# Altium project smart_charger.PrjPcb
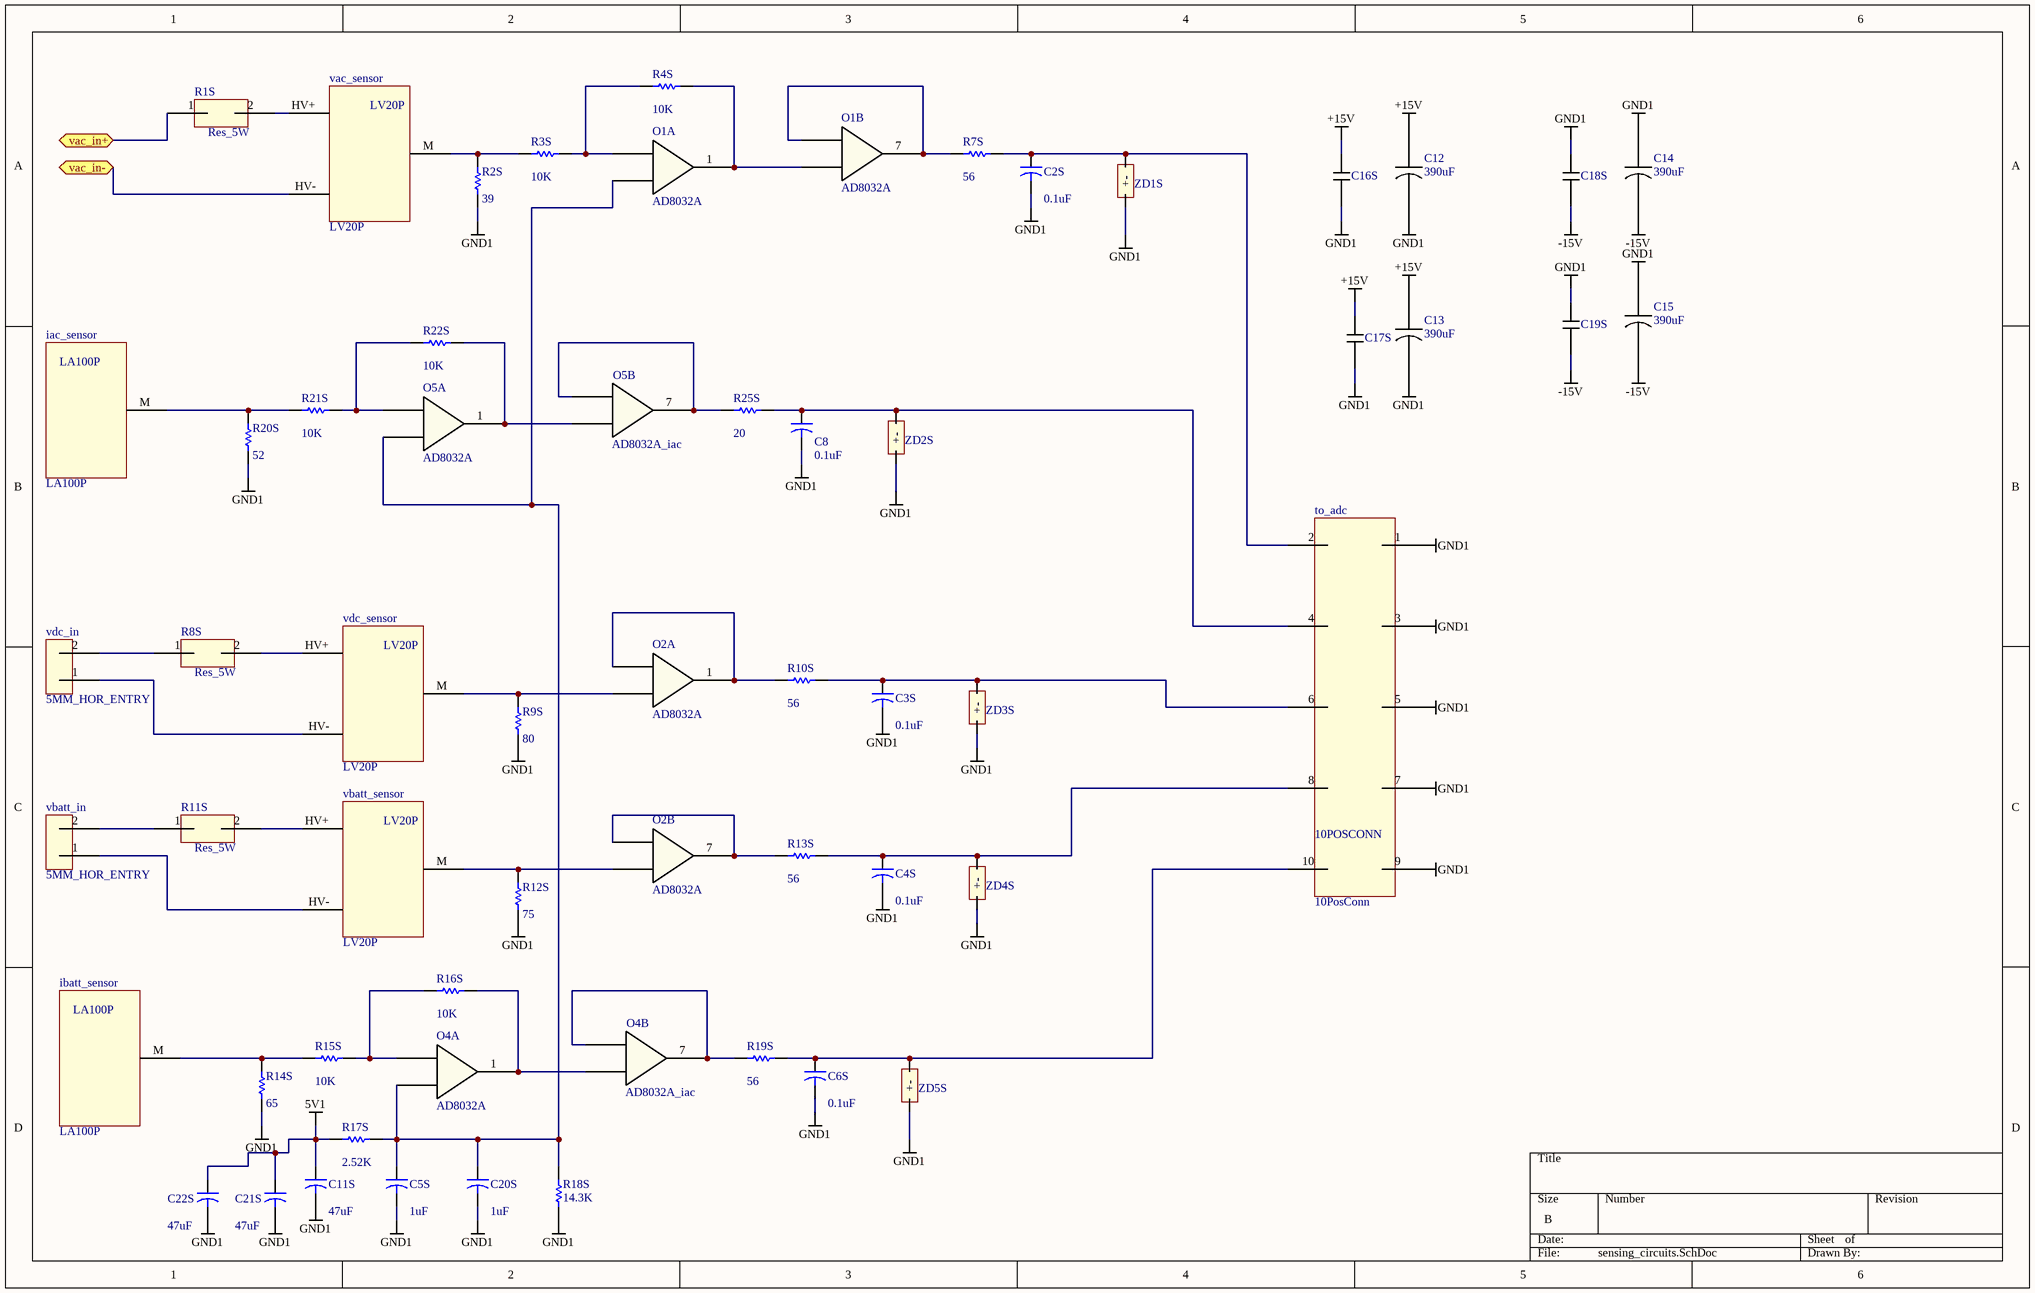
[diagram p0: sensing_circuits.SchDoc]
4 sheets, 179 parts. Net scope: flat (ports and power ports of the same name join across sheets).
Board file: smart_charger_pcb.PcbDoc
Sheets:
  sensing_circuits.SchDoc
  fo_tx_array.SchDoc
  gate_driver_array.SchDoc
  power_supplies.SchDoc

## Sheet sensing_circuits.SchDoc
size B

### Parts
C2S  value 0.1uF  [CAPR5-4X5]  (hidden comment: C2)
C3S  value 0.1uF  [CAPR5-4X5]  (hidden comment: C3)
C4S  value 0.1uF  [CAPR5-4X5]  (hidden comment: C4)
C5S  value 1uF  [CAPR5-4X5]  (hidden comment: C5)
C6S  value 0.1uF  [CAPR5-4X5]  (hidden comment: C6)
C8S  C8  value 0.1uF  [CAPR5-4X5]
C11S  value 47uF  [CAPR5-4X5]  (hidden comment: C11)
C12  Capacitance: 390uF  [Cap_Pol_5mm]  (hidden comment: C12)
C13  Capacitance: 390uF  [Cap_Pol_5mm]  (hidden comment: C12)
C14  Capacitance: 390uF  [Cap_Pol_5mm]  (hidden comment: C12)
C15  Capacitance: 390uF  [Cap_Pol_5mm]  (hidden comment: C12)
C16S  CAP_CERAM_5MM  [CAP_CERAM_5MM]  (value not drawn)
C17S  CAP_CERAM_5MM  [CAP_CERAM_5MM]  (value not drawn)
C18S  CAP_CERAM_5MM  [CAP_CERAM_5MM]  (value not drawn)
C19S  CAP_CERAM_5MM  [CAP_CERAM_5MM]  (value not drawn)
C20S  value 1uF  [CAPR5-4X5]  (hidden comment: C20)
C21S  value 47uF  [CAPR5-4X5]  (hidden comment: C21)
C22S  value 47uF  [CAPR5-4X5]  (hidden comment: C22)
iac_sensor  LA100P  [LA100P]
ibatt_sensor  LA100P  [LA100P]
O1  AD8032A  [AD8032A]  (parts A,B of 2)
O2  AD8032A  [AD8032A]  (parts A,B of 2)
O4  AD8032A  [AD8032A]  (parts A,B of 2)
O5  AD8032A  [AD8032A]  (parts A,B of 2)
R1S  R1  [Res_Vishay_5W]  (value not drawn)
R2S  value 39  [AXIAL-0.3]  (hidden comment: R2)
R3S  value 10K  [AXIAL-0.3]  (hidden comment: R3)
R4S  value 10K  [AXIAL-0.3]  (hidden comment: R4)
R7S  value 56  [AXIAL-0.3]  (hidden comment: R7)
R8S  R8  [Res_Vishay_5W]  (value not drawn)
R9S  value 80  [AXIAL-0.3]  (hidden comment: R9)
R10S  value 56  [AXIAL-0.3]  (hidden comment: R10)
R11S  R11  [Res_Vishay_5W]  (value not drawn)
R12S  value 75  [AXIAL-0.3]  (hidden comment: R12)
R13S  value 56  [AXIAL-0.3]  (hidden comment: R13)
R14S  value 65  [AXIAL-0.3]  (hidden comment: R14)
R15S  value 10K  [AXIAL-0.3]  (hidden comment: R15)
R16S  value 10K  [AXIAL-0.3]  (hidden comment: R16)
R17S  value 2.52K  [AXIAL-0.3]  (hidden comment: R17)
R18S  value 14.3K  [AXIAL-0.3]  (hidden comment: R18)
R19S  value 56  [AXIAL-0.3]  (hidden comment: R19)
R20S  value 52  [AXIAL-0.3]  (hidden comment: R20)
R21S  value 10K  [AXIAL-0.3]  (hidden comment: R21)
R22S  value 10K  [AXIAL-0.3]  (hidden comment: R22)
R25S  value 20  [AXIAL-0.3]  (hidden comment: R25)
to_adc  10PosConn  [Conn_10Pos]
vac_sensor  LV20P  [LV20P]
vbatt_in  5MM_HOR_ENTRY  [5MM_HOR_ENTRY]
vbatt_sensor  LV20P  [LV20P]
vdc_in  5MM_HOR_ENTRY  [5MM_HOR_ENTRY]
vdc_sensor  LV20P  [LV20P]
ZD1S  ZENER_0.4W  [ZENER400mW]  (value not drawn)
ZD2S  ZENER_0.4W  [ZENER400mW]  (value not drawn)
ZD3S  ZENER_0.4W  [ZENER400mW]  (value not drawn)
ZD4S  ZENER_0.4W  [ZENER400mW]  (value not drawn)
ZD5S  ZENER_0.4W  [ZENER400mW]  (value not drawn)

### Ports
vac_in+ (bidir), vac_in- (bidir)

### Nets
5V1: C11S.1 C21S.1 C22S.1 O1.8 O2.8 O4.8 O5.8 R17S.2
+15V: C12.1 C13.1 C16S.2 C17S.2 iac_sensor.+ ibatt_sensor.+ vac_sensor.+15V vbatt_sensor.+15V vdc_sensor.+15V
-15V: C14.2 C15.2 C18S.1 C19S.1 iac_sensor.- ibatt_sensor.- vac_sensor.-15V vbatt_sensor.-15V vdc_sensor.-15V
GND1: C2S.2 C3S.2 C4S.2 C5S.2 C6S.2 C8S.2 C11S.2 C12.2 C13.2 C14.1 C15.1 C16S.1 C17S.1 C18S.2 C19S.2 C20S.2 C21S.2 C22S.2 O1.4 O2.4 O4.4 O5.4 R2S.1 R9S.1 R12S.1 R14S.1 R18S.2 R20S.1 to_adc.1 to_adc.3 to_adc.5 to_adc.7 to_adc.9 ZD1S.1(+) ZD2S.1(+) ZD3S.1(+) ZD4S.1(+) ZD5S.1(+)
NetC2S_1: C2S.1 R7S.1 to_adc.2 ZD1S.2(-)
NetC3S_1: C3S.1 R10S.2 to_adc.6 ZD3S.2(-)
NetC4S_1: C4S.1 R13S.2 to_adc.8 ZD4S.2(-)
NetC5S_1: C5S.1 C20S.1 O1.3 O4.3 O5.3 R17S.1 R18S.1
NetC6S_1: C6S.1 R19S.1 to_adc.10 ZD5S.2(-)
NetC8S_1: C8S.1 R25S.1 to_adc.4 ZD2S.2(-)
NetFUSE1_1: R1S.1 ; port vac_in+
Netiac_sensor_M: iac_sensor.M R20S.2 R21S.2
Netibatt_sensor_M: ibatt_sensor.M R14S.2 R15S.2
NetO1_1: O1.1 O1.5 R4S.1
NetO1_2: O1.2 R3S.1 R4S.2
NetO1_6: O1.6 O1.7 R7S.2
NetO2_1: O2.1 O2.2 R10S.1
NetO2_3: O2.3 R9S.2 vdc_sensor.M
NetO2_5: O2.5 R12S.2 vbatt_sensor.M
NetO2_6: O2.6 O2.7 R13S.1
NetO4_1: O4.1 O4.5 R16S.1
NetO4_2: O4.2 R15S.1 R16S.2
NetO4_6: O4.6 O4.7 R19S.2
NetO5_1: O5.1 O5.5 R22S.1
NetO5_2: O5.2 R21S.1 R22S.2
NetO5_6: O5.6 O5.7 R25S.2
NetPS1_ACN: vac_sensor.HV- ; port vac_in-
NetR1S_2: R1S.2 vac_sensor.HV+
NetR2S_2: R2S.2 R3S.2 vac_sensor.M
NetR8S_1: R8S.1 vdc_in.2
NetR8S_2: R8S.2 vdc_sensor.HV+
NetR11S_1: R11S.1 vbatt_in.2
NetR11S_2: R11S.2 vbatt_sensor.HV+
Netvbatt_in_1: vbatt_in.1 vbatt_sensor.HV-
Netvdc_in_1: vdc_in.1 vdc_sensor.HV-

### Notes on the sheet
- (in symbol 10PosConn) 10POSCONN
- (in symbol Res_Vishay_5W) Res_5W

### Library data of the parts
C2S C3S C4S C5S C6S C8S C11S C20S C21S C22S = Cap2: Capacitor; Published: 23-Sep-2002; PackageReference: CAPR5-4X5; Publisher: Altium Limited; PackageDescription: Capacitor; 2 Leads
C12-C15 = Cap_Pol_5
R1S = Res_Vishay_5W: Resistance: 15k
R2S R3S R4S R7S R9S R10S R12S R13S R14S R15S R16S R17S R18S R19S R20S R21S R22S R25S = Res1: Resistor; Published: 8-Jun-2000; LatestRevisionDate: 17-Jul-2002; LatestRevisionNote: Re-released for DXP Platform.; PackageReference: AXIAL-0.3; Publisher: Altium Limited; PackageDescription: Axial Device, Thru-Hole; 2 Leads; 0.3 in Pin Spacing
R8S = Res_Vishay_5W: Resistance: 25k
R11S = Res_Vishay_5W: Resistance: 10k

## Sheet fo_tx_array.SchDoc
size A3
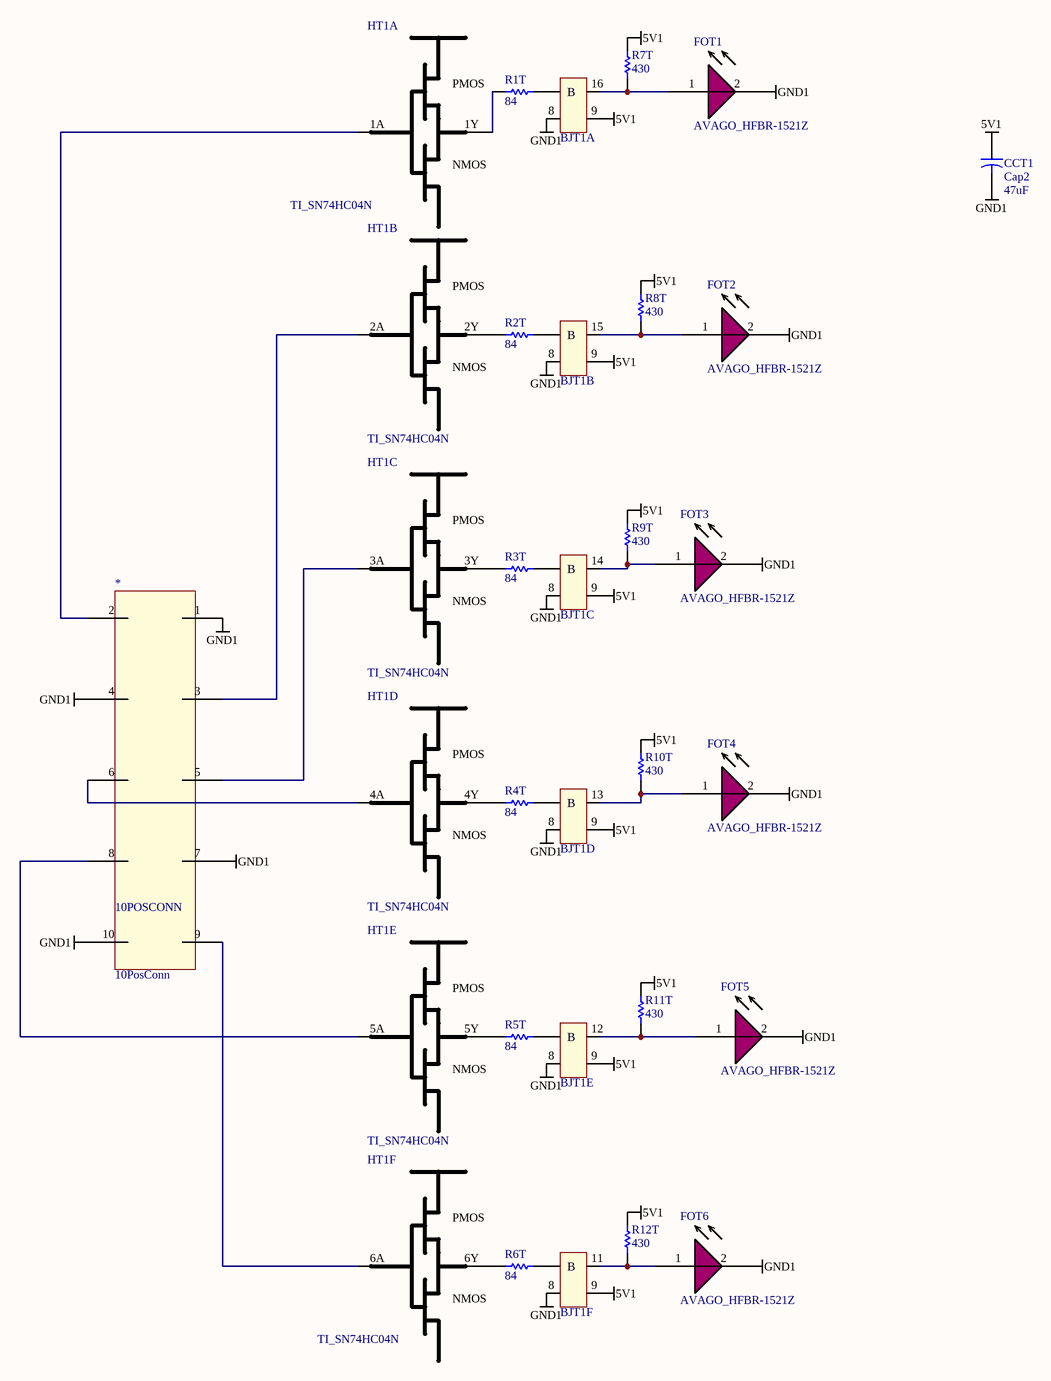
[diagram p1: fo_tx_array.SchDoc]

### Parts
*  10PosConn  [Conn_10Pos]
BJT1  ULN2003AN  [ULN2003AN]  (value not drawn)  (parts A,B,C,D,E,F of 7)
CCT1  Cap2  value 47uF  [CAPR5-4X5]
FOT1  AVAGO_HFBR-1521Z  [AVAGO_HFBR-1521Z]
FOT2  AVAGO_HFBR-1521Z  [AVAGO_HFBR-1521Z]
FOT3  AVAGO_HFBR-1521Z  [AVAGO_HFBR-1521Z]
FOT4  AVAGO_HFBR-1521Z  [AVAGO_HFBR-1521Z]
FOT5  AVAGO_HFBR-1521Z  [AVAGO_HFBR-1521Z]
FOT6  AVAGO_HFBR-1521Z  [AVAGO_HFBR-1521Z]
HT1  TI_SN74HC04N  [SN74HC04N]  (parts A,B,C,D,E,F of 7)
R1T  value 84  [AXIAL-0.3]
R2T  value 84  [AXIAL-0.3]
R3T  value 84  [AXIAL-0.3]
R4T  value 84  [AXIAL-0.3]
R5T  value 84  [AXIAL-0.3]
R6T  value 84  [AXIAL-0.3]
R7T  value 430  [AXIAL-0.3]  (hidden comment: Res1)
R8T  value 430  [AXIAL-0.3]  (hidden comment: Res1)
R9T  value 430  [AXIAL-0.3]  (hidden comment: Res1)
R10T  value 430  [AXIAL-0.3]  (hidden comment: Res1)
R11T  value 430  [AXIAL-0.3]  (hidden comment: Res1)
R12T  value 430  [AXIAL-0.3]  (hidden comment: Res1)

### Nets
5V1: BJT1.9(COM) CCT1.1 HT1.5V R7T.1 R8T.1 R9T.1 R10T.1 R11T.1 R12T.1
GND1: *.1 *.4 *.7 *.10 BJT1.8(E) CCT1.2 FOT1.2 FOT2.2 FOT3.2 FOT4.2 FOT5.2 FOT6.2 HT1.GND
Net*_2: *.2 HT1.1A
Net*_3: *.3 HT1.2A
Net*_5: *.5 HT1.3A
Net*_6: *.6 HT1.4A
Net*_8: *.8 HT1.5A
Net*_9: *.9 HT1.6A
NetBJT1_1: BJT1.1(B) R1T.2
NetBJT1_2: BJT1.2(B) R2T.2
NetBJT1_3: BJT1.3(B) R3T.2
NetBJT1_4: BJT1.4(B) R4T.2
NetBJT1_5: BJT1.5(B) R5T.2
NetBJT1_6: BJT1.6(B) R6T.2
NetBJT1_11: BJT1.11(C) FOT6.1 R12T.2
NetBJT1_12: BJT1.12(C) FOT5.1 R11T.2
NetBJT1_13: BJT1.13(C) FOT4.1 R10T.2
NetBJT1_14: BJT1.14(C) FOT3.1 R9T.2
NetBJT1_15: BJT1.15(C) FOT2.1 R8T.2
NetBJT1_16: BJT1.16(C) FOT1.1 R7T.2
NetHT1_1Y: HT1.1Y R1T.1
NetHT1_2Y: HT1.2Y R2T.1
NetHT1_3Y: HT1.3Y R3T.1
NetHT1_4Y: HT1.4Y R4T.1
NetHT1_5Y: HT1.5Y R5T.1
NetHT1_6Y: HT1.6Y R6T.1

### Notes on the sheet
- (in symbol 10PosConn) 10POSCONN
- (in symbol TI_SN74HC04N, part A) PMOS; NMOS
- (in symbol TI_SN74HC04N, part B) PMOS; NMOS
- (in symbol TI_SN74HC04N, part C) PMOS; NMOS
- (in symbol TI_SN74HC04N, part D) PMOS; NMOS
- (in symbol TI_SN74HC04N, part E) PMOS; NMOS
- (in symbol TI_SN74HC04N, part F) PMOS; NMOS

### Library data of the parts
CCT1 = Cap2: Capacitor; Published: 23-Sep-2002; PackageReference: CAPR5-4X5; Publisher: Altium Limited; PackageDescription: Capacitor; 2 Leads
FOT1-FOT6 = AVAGO_HFBR-1521Z: Optical Fiber Transmitter
HT1 = TI_SN74HC04N: Hex Inverter 5V
R1T R2T R3T R4T R5T R6T R7T R8T R9T R10T R11T R12T = Res1: Resistor; Published: 8-Jun-2000; LatestRevisionDate: 17-Jul-2002; LatestRevisionNote: Re-released for DXP Platform.; PackageReference: AXIAL-0.3; Publisher: Altium Limited; PackageDescription: Axial Device, Thru-Hole; 2 Leads; 0.3 in Pin Spacing

## Sheet gate_driver_array.SchDoc
size A3
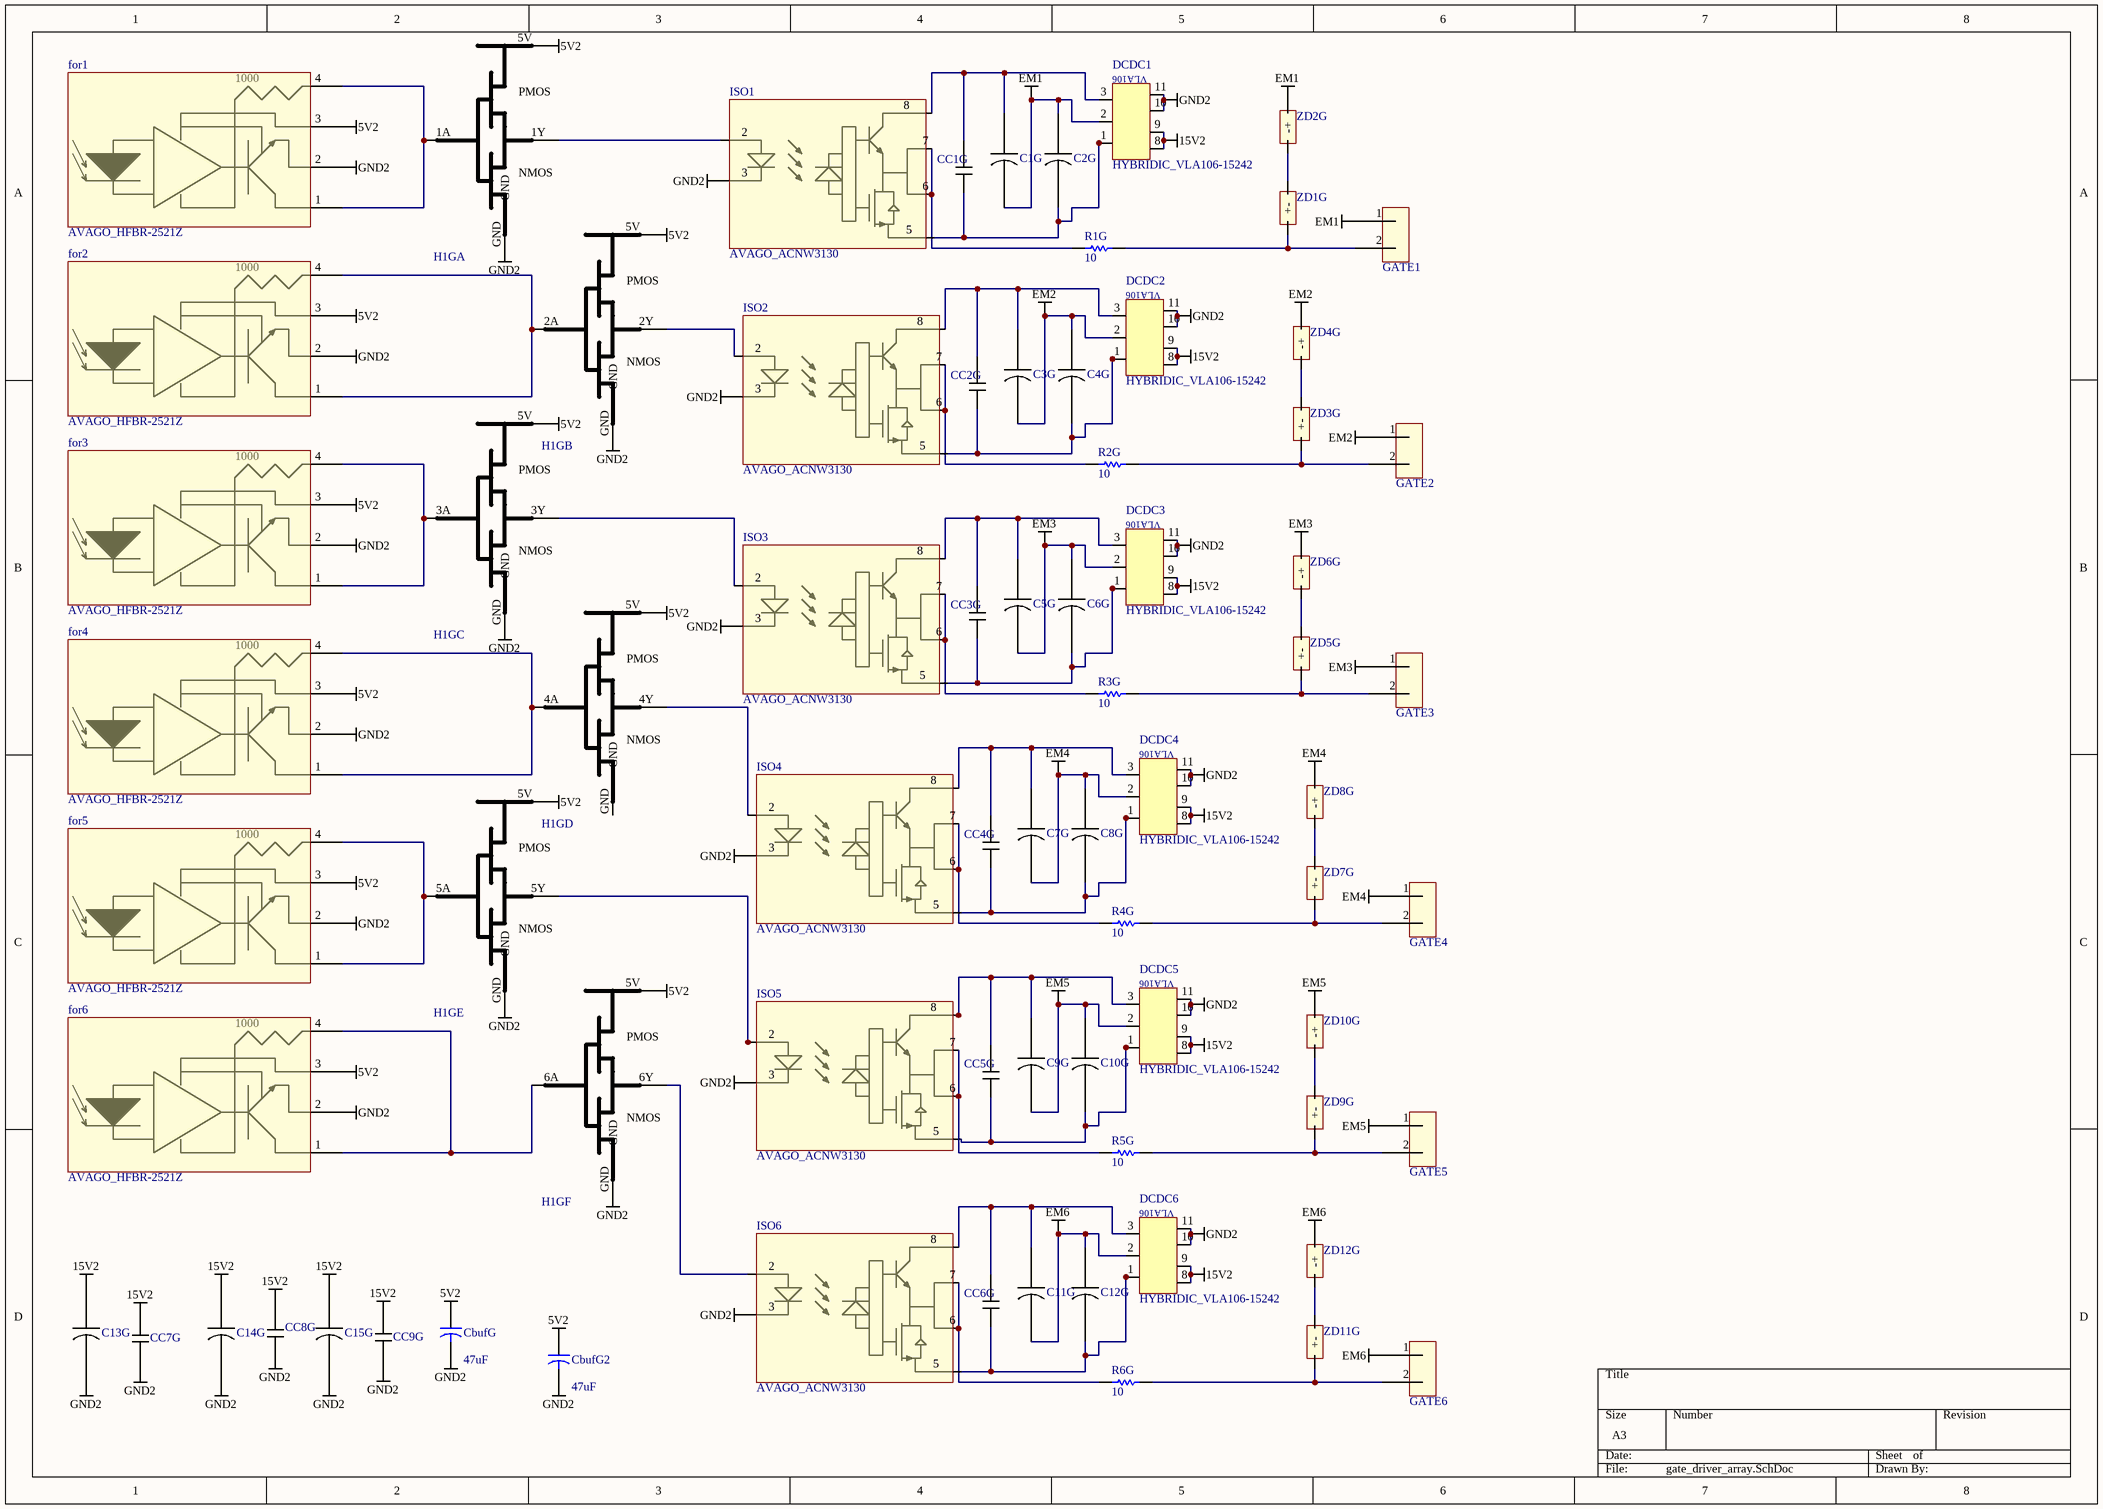
[diagram p2: gate_driver_array.SchDoc]

### Parts
C1G  Cap_Pol_5  [Cap_Pol_5mm]  (value not drawn)
C2G  Cap_Pol_5  [Cap_Pol_5mm]  (value not drawn)
C3G  Cap_Pol_5  [Cap_Pol_5mm]  (value not drawn)
C4G  Cap_Pol_5  [Cap_Pol_5mm]  (value not drawn)
C5G  Cap_Pol_5  [Cap_Pol_5mm]  (value not drawn)
C6G  Cap_Pol_5  [Cap_Pol_5mm]  (value not drawn)
C7G  Cap_Pol_5  [Cap_Pol_5mm]  (value not drawn)
C8G  Cap_Pol_5  [Cap_Pol_5mm]  (value not drawn)
C9G  Cap_Pol_5  [Cap_Pol_5mm]  (value not drawn)
C10G  Cap_Pol_5  [Cap_Pol_5mm]  (value not drawn)
C11G  Cap_Pol_5  [Cap_Pol_5mm]  (value not drawn)
C12G  Cap_Pol_5  [Cap_Pol_5mm]  (value not drawn)
C13G  Cap_Pol_5  [Cap_Pol_5mm]  (value not drawn)
C14G  Cap_Pol_5  [Cap_Pol_5mm]  (value not drawn)
C15G  Cap_Pol_5  [Cap_Pol_5mm]  (value not drawn)
CbufG  value 47uF  [CAPR5-4X5]  (hidden comment: Cap2)
CbufG2  value 47uF  [CAPR5-4X5]  (hidden comment: Cap2)
CC1G  CAP_CERAM_5MM  [CAP_CERAM_5MM]  (value not drawn)
CC2G  CAP_CERAM_5MM  [CAP_CERAM_5MM]  (value not drawn)
CC3G  CAP_CERAM_5MM  [CAP_CERAM_5MM]  (value not drawn)
CC4G  CAP_CERAM_5MM  [CAP_CERAM_5MM]  (value not drawn)
CC5G  CAP_CERAM_5MM  [CAP_CERAM_5MM]  (value not drawn)
CC6G  CAP_CERAM_5MM  [CAP_CERAM_5MM]  (value not drawn)
CC7G  CAP_CERAM_5MM  [CAP_CERAM_5MM]  (value not drawn)
CC8G  CAP_CERAM_5MM  [CAP_CERAM_5MM]  (value not drawn)
CC9G  CAP_CERAM_5MM  [CAP_CERAM_5MM]  (value not drawn)
DCDC1  HYBRIDIC_VLA106-15242  [HYBRIDIC_VLA106-15242]
DCDC2  HYBRIDIC_VLA106-15242  [HYBRIDIC_VLA106-15242]
DCDC3  HYBRIDIC_VLA106-15242  [HYBRIDIC_VLA106-15242]
DCDC4  HYBRIDIC_VLA106-15242  [HYBRIDIC_VLA106-15242]
DCDC5  HYBRIDIC_VLA106-15242  [HYBRIDIC_VLA106-15242]
DCDC6  HYBRIDIC_VLA106-15242  [HYBRIDIC_VLA106-15242]
for1  AVAGO_HFBR-2521Z  [AVAGO_HFBR-2521Z]
for2  AVAGO_HFBR-2521Z  [AVAGO_HFBR-2521Z]
for3  AVAGO_HFBR-2521Z  [AVAGO_HFBR-2521Z]
for4  AVAGO_HFBR-2521Z  [AVAGO_HFBR-2521Z]
for5  AVAGO_HFBR-2521Z  [AVAGO_HFBR-2521Z]
for6  AVAGO_HFBR-2521Z  [AVAGO_HFBR-2521Z]
GATE1  5MM_HOR_ENTRY  [5MM_HOR_ENTRY]  (value not drawn)
GATE2  5MM_HOR_ENTRY  [5MM_HOR_ENTRY]  (value not drawn)
GATE3  5MM_HOR_ENTRY  [5MM_HOR_ENTRY]  (value not drawn)
GATE4  5MM_HOR_ENTRY  [5MM_HOR_ENTRY]  (value not drawn)
GATE5  5MM_HOR_ENTRY  [5MM_HOR_ENTRY]  (value not drawn)
GATE6  5MM_HOR_ENTRY  [5MM_HOR_ENTRY]  (value not drawn)
H1G  TI_SN74HC04N  [SN74HC04N]  (value not drawn)  (parts A,B,C,D,E,F of 7)
ISO1  AVAGO_ACNW3130  [AVAGO_ACNW3130]
ISO2  AVAGO_ACNW3130  [AVAGO_ACNW3130]
ISO3  AVAGO_ACNW3130  [AVAGO_ACNW3130]
ISO4  AVAGO_ACNW3130  [AVAGO_ACNW3130]
ISO5  AVAGO_ACNW3130  [AVAGO_ACNW3130]
ISO6  AVAGO_ACNW3130  [AVAGO_ACNW3130]
R1G  value 10  [AXIAL-0.3]  (hidden comment: Res1)
R2G  value 10  [AXIAL-0.3]  (hidden comment: Res1)
R3G  value 10  [AXIAL-0.3]  (hidden comment: Res1)
R4G  value 10  [AXIAL-0.3]  (hidden comment: Res1)
R5G  value 10  [AXIAL-0.3]  (hidden comment: Res1)
R6G  value 10  [AXIAL-0.3]  (hidden comment: Res1)
ZD1G  ZENER_1W  [ZENER_1W]  (value not drawn)
ZD2G  ZENER_1W  [ZENER_1W]  (value not drawn)
ZD3G  ZENER_1W  [ZENER_1W]  (value not drawn)
ZD4G  ZENER_1W  [ZENER_1W]  (value not drawn)
ZD5G  ZENER_1W  [ZENER_1W]  (value not drawn)
ZD6G  ZENER_1W  [ZENER_1W]  (value not drawn)
ZD7G  ZENER_1W  [ZENER_1W]  (value not drawn)
ZD8G  ZENER_1W  [ZENER_1W]  (value not drawn)
ZD9G  ZENER_1W  [ZENER_1W]  (value not drawn)
ZD10G  ZENER_1W  [ZENER_1W]  (value not drawn)
ZD11G  ZENER_1W  [ZENER_1W]  (value not drawn)
ZD12G  ZENER_1W  [ZENER_1W]  (value not drawn)

### Nets
5V2: CbufG.1 CbufG2.1 for1.3 for2.3 for3.3 for4.3 for5.3 for6.3 H1G.5V
15V2: C13G.1 C14G.1 C15G.1 CC7G.2 CC8G.1 CC9G.2 DCDC1.8 DCDC1.9 DCDC2.8 DCDC2.9 DCDC3.8 DCDC3.9 DCDC4.8 DCDC4.9 DCDC5.8 DCDC5.9 DCDC6.8 DCDC6.9
EM1: C1G.2 C2G.1 DCDC1.2 GATE1.1 ZD2G.1(+)
EM2: C3G.2 C4G.1 DCDC2.2 GATE2.1 ZD4G.1(+)
EM3: C5G.2 C6G.1 DCDC3.2 GATE3.1 ZD6G.1(+)
EM4: C7G.2 C8G.1 DCDC4.2 GATE4.1 ZD8G.1(+)
EM5: C9G.2 C10G.1 DCDC5.2 GATE5.1 ZD10G.1(+)
EM6: C11G.2 C12G.1 DCDC6.2 GATE6.1 ZD12G.1(+)
GND2: C13G.2 C14G.2 C15G.2 CbufG.2 CbufG2.2 CC7G.1 CC8G.2 CC9G.1 DCDC1.10 DCDC1.11 DCDC2.10 DCDC2.11 DCDC3.10 DCDC3.11 DCDC4.10 DCDC4.11 DCDC5.10 DCDC5.11 DCDC6.10 DCDC6.11 for1.2 for2.2 for3.2 for4.2 for5.2 for6.2 H1G.GND ISO1.3 ISO2.3 ISO3.3 ISO4.3 ISO5.3 ISO6.3
NetC1G_1: C1G.1 CC1G.1 DCDC1.3 ISO1.8
NetC2G_2: C2G.2 CC1G.2 DCDC1.1 ISO1.5
NetC3G_1: C3G.1 CC2G.1 DCDC2.3 ISO2.8
NetC4G_2: C4G.2 CC2G.2 DCDC2.1 ISO2.5
NetC5G_1: C5G.1 CC3G.1 DCDC3.3 ISO3.8
NetC6G_2: C6G.2 CC3G.2 DCDC3.1 ISO3.5
NetC7G_1: C7G.1 CC4G.1 DCDC4.3 ISO4.8
NetC8G_2: C8G.2 CC4G.2 DCDC4.1 ISO4.5
NetC9G_1: C9G.1 CC5G.1 DCDC5.3 ISO5.8
NetC10G_2: C10G.2 CC5G.2 DCDC5.1 ISO5.5
NetC11G_1: C11G.1 CC6G.1 DCDC6.3 ISO6.8
NetC12G_2: C12G.2 CC6G.2 DCDC6.1 ISO6.5
Netfor1_1: for1.1 for1.4 H1G.1A
Netfor2_1: for2.1 for2.4 H1G.2A
Netfor3_1: for3.1 for3.4 H1G.3A
Netfor4_1: for4.1 for4.4 H1G.4A
Netfor5_1: for5.1 for5.4 H1G.5A
Netfor6_1: for6.1 for6.4 H1G.6A
NetGATE1_2: GATE1.2 R1G.2 ZD1G.1(+)
NetGATE2_2: GATE2.2 R2G.2 ZD3G.1(+)
NetGATE3_2: GATE3.2 R3G.2 ZD5G.1(+)
NetGATE4_2: GATE4.2 R4G.2 ZD7G.1(+)
NetGATE5_2: GATE5.2 R5G.2 ZD9G.1(+)
NetGATE6_2: GATE6.2 R6G.2 ZD11G.1(+)
NetH1G_1Y: H1G.1Y ISO1.2
NetH1G_2Y: H1G.2Y ISO2.2
NetH1G_3Y: H1G.3Y ISO3.2
NetH1G_4Y: H1G.4Y ISO4.2
NetH1G_5Y: H1G.5Y ISO5.2
NetH1G_6Y: H1G.6Y ISO6.2
NetISO1_6: ISO1.6 ISO1.7 R1G.1
NetISO2_6: ISO2.6 ISO2.7 R2G.1
NetISO3_6: ISO3.6 ISO3.7 R3G.1
NetISO4_6: ISO4.6 ISO4.7 R4G.1
NetISO5_6: ISO5.6 ISO5.7 R5G.1
NetISO6_6: ISO6.6 ISO6.7 R6G.1
NetZD1G_2: ZD1G.2(-) ZD2G.2(-)
NetZD3G_2: ZD3G.2(-) ZD4G.2(-)
NetZD5G_2: ZD5G.2(-) ZD6G.2(-)
NetZD7G_2: ZD7G.2(-) ZD8G.2(-)
NetZD9G_2: ZD9G.2(-) ZD10G.2(-)
NetZD11G_2: ZD11G.2(-) ZD12G.2(-)

### Notes on the sheet
- (in symbol AVAGO_HFBR-2521Z) 1000
- (in symbol HYBRIDIC_VLA106-15242) VLA106
- (in symbol TI_SN74HC04N, part A) PMOS; NMOS
- (in symbol TI_SN74HC04N, part B) PMOS; NMOS
- (in symbol TI_SN74HC04N, part C) PMOS; NMOS
- (in symbol TI_SN74HC04N, part D) PMOS; NMOS
- (in symbol TI_SN74HC04N, part E) PMOS; NMOS
- (in symbol TI_SN74HC04N, part F) PMOS; NMOS

### Library data of the parts
C1G = Cap_Pol_5: Capacitance: 390uF
CbufG CbufG2 = Cap2: Capacitor; Published: 23-Sep-2002; PackageReference: CAPR5-4X5; Publisher: Altium Limited; PackageDescription: Capacitor; 2 Leads
DCDC1-DCDC6 = HYBRIDIC_VLA106-15242: Isolated DC/DC Converter
for1-for6 = AVAGO_HFBR-2521Z: Optical Fiber Receiver
H1G = TI_SN74HC04N: Hex Inverter 5V
ISO1-ISO6 = AVAGO_ACNW3130: IGBT Gate Drive Optocoupler
R1G R2G R3G R4G R5G R6G = Res1: Resistor; Published: 8-Jun-2000; LatestRevisionDate: 17-Jul-2002; LatestRevisionNote: Re-released for DXP Platform.; PackageReference: AXIAL-0.3; Publisher: Altium Limited; PackageDescription: Axial Device, Thru-Hole; 2 Leads; 0.3 in Pin Spacing

## Sheet power_supplies.SchDoc
size A
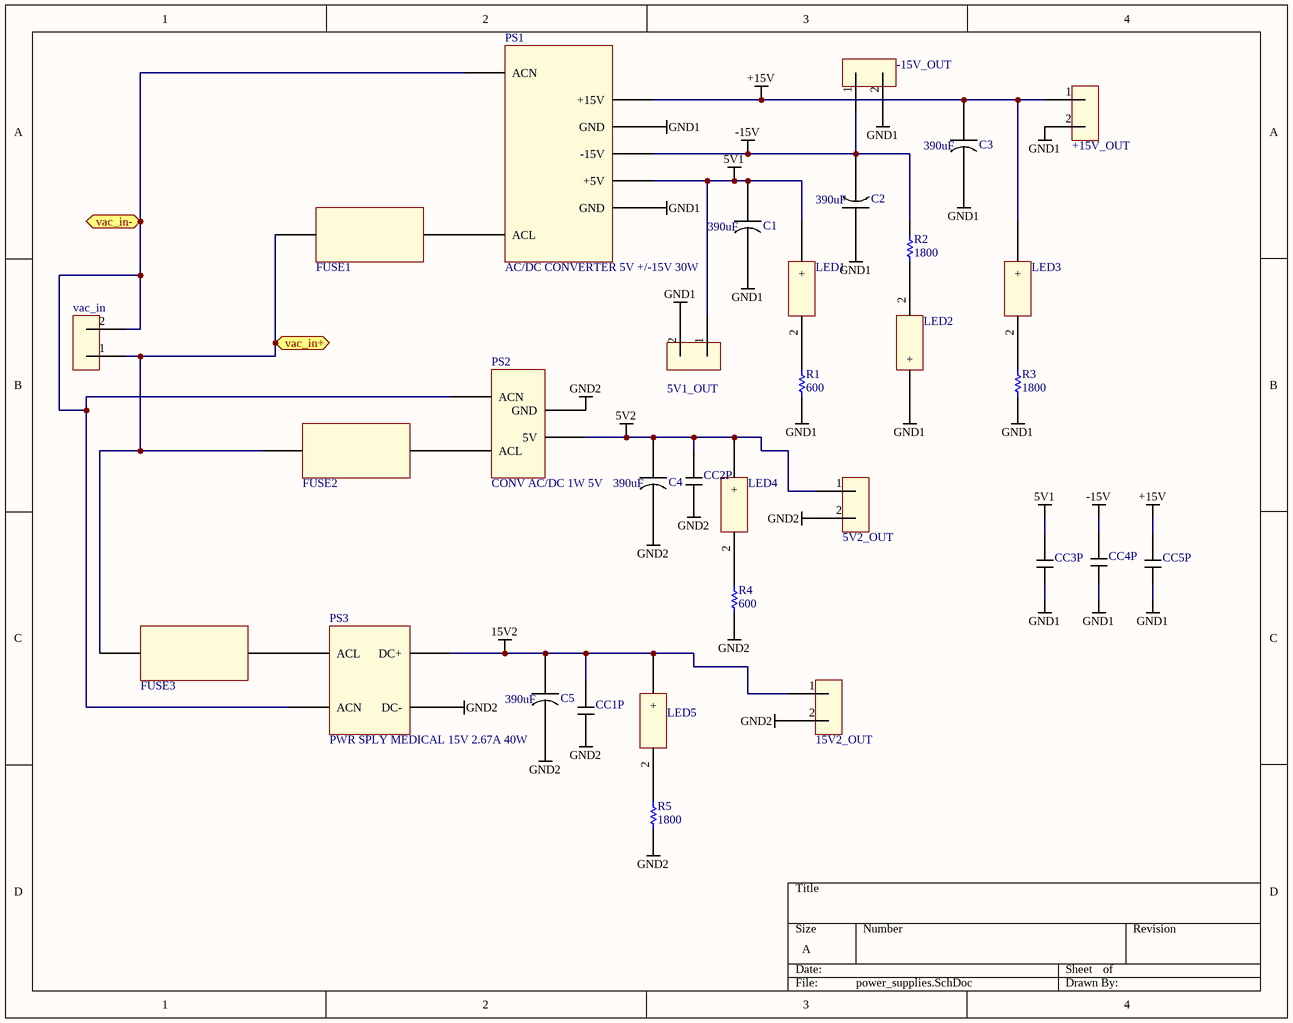
[diagram p3: power_supplies.SchDoc]

### Parts
5V1_OUT  5MM_HOR_ENTRY  [5MM_HOR_ENTRY]  (value not drawn)
5V2_OUT  5MM_HOR_ENTRY  [5MM_HOR_ENTRY]  (value not drawn)
15V2_OUT  5MM_HOR_ENTRY  [5MM_HOR_ENTRY]  (value not drawn)
+15V_OUT  5MM_HOR_ENTRY  [5MM_HOR_ENTRY]  (value not drawn)
-15V_OUT  5MM_HOR_ENTRY  [5MM_HOR_ENTRY]  (value not drawn)
C1  Capacitance: 390uF  [Cap_Pol_5mm]  (hidden comment: C1)
C2  Capacitance: 390uF  [Cap_Pol_5mm]  (hidden comment: C1)
C3  Capacitance: 390uF  [Cap_Pol_5mm]  (hidden comment: C1)
C4  Capacitance: 390uF  [Cap_Pol_5mm]  (hidden comment: C1)
C5  Capacitance: 390uF  [Cap_Pol_5mm]  (hidden comment: C1)
CC1P  CAP_CERAM_5MM  [CAP_CERAM_5MM]  (value not drawn)
CC2P  CAP_CERAM_5MM  [CAP_CERAM_5MM]  (value not drawn)
CC3P  CAP_CERAM_5MM  [CAP_CERAM_5MM]  (value not drawn)
CC4P  CAP_CERAM_5MM  [CAP_CERAM_5MM]  (value not drawn)
CC5P  CAP_CERAM_5MM  [CAP_CERAM_5MM]  (value not drawn)
FUSE1  fuse < 5A  [Fuse < 5A]  (value not drawn)
FUSE2  fuse < 5A  [Fuse < 5A]  (value not drawn)
FUSE3  fuse < 5A  [Fuse < 5A]  (value not drawn)
LED1  LED  [LED]  (value not drawn)
LED2  LED  [LED]  (value not drawn)
LED3  LED  [LED]  (value not drawn)
LED4  LED  [LED]  (value not drawn)
LED5  LED  [LED]  (value not drawn)
PS1  AC/DC CONVERTER 5V +/-15V 30W  [AC/DC CONVERTER 5V +/-15V 30W]
PS2  CONV AC/DC 1W 5V  [CONV AC/DC 1W 5V]
PS3  PWR SPLY MEDICAL 15V 2.67A 40W  [PWR SPLY MEDICAL 15V 2.67A 40W]
R1  value 600  [AXIAL-0.3]  (hidden comment: Res1)
R2  value 1800  [AXIAL-0.3]  (hidden comment: Res1)
R3  value 1800  [AXIAL-0.3]  (hidden comment: Res1)
R4  value 600  [AXIAL-0.3]  (hidden comment: Res1)
R5  value 1800  [AXIAL-0.3]  (hidden comment: Res1)
vac_in  5MM_HOR_ENTRY  [5MM_HOR_ENTRY]  (value not drawn)

### Ports
vac_in+ (bidir), vac_in- (bidir)

### Nets
5V1: 5V1_OUT.1 C1.1 CC3P.1 LED1.1(+) PS1.2(+5V)
5V2: 5V2_OUT.1 C4.1 CC2P.1 LED4.1(+) PS2.4(5V)
15V2: 15V2_OUT.1 C5.1 CC1P.1 LED5.1(+) PS3.3(DC+)
+15V: +15V_OUT.1 C3.1 CC5P.1 LED3.1(+) PS1.5(+15V)
-15V: -15V_OUT.1 C2.2 CC4P.1 PS1.3(-15V) R2.1
GND1: 5V1_OUT.2 +15V_OUT.2 -15V_OUT.2 C1.2 C2.1 C3.2 CC3P.2 CC4P.2 CC5P.2 LED2.1(+) PS1.1(GND) PS1.4(GND) R1.1 R3.1
GND2: 5V2_OUT.2 15V2_OUT.2 C4.2 C5.2 CC1P.2 CC2P.2 PS2.3(GND) PS3.5(DC-) R4.1 R5.2
NetFUSE1_1: FUSE1.1 FUSE2.1 FUSE3.1 vac_in.1 ; port vac_in+
NetFUSE1_2: FUSE1.2 PS1.ACL
NetFUSE2_2: FUSE2.2 PS2.2(ACL)
NetFUSE3_2: FUSE3.2 PS3.1(ACL)
NetLED1_2: LED1.2(-) R1.2
NetLED2_2: LED2.2(-) R2.2
NetLED3_2: LED3.2(-) R3.2
NetLED4_2: LED4.2(-) R4.2
NetLED5_2: LED5.2(-) R5.1
NetPS1_ACN: PS1.ACN PS2.1(ACN) PS3.2(ACN) vac_in.2 ; port vac_in-

### Library data of the parts
C1-C5 = Cap_Pol_5
R1-R5 = Res1: Resistor; Published: 8-Jun-2000; LatestRevisionDate: 17-Jul-2002; LatestRevisionNote: Re-released for DXP Platform.; PackageReference: AXIAL-0.3; Publisher: Altium Limited; PackageDescription: Axial Device, Thru-Hole; 2 Leads; 0.3 in Pin Spacing

## Nets that join several sheets
5V1: sensing_circuits (8 pins), fo_tx_array (9 pins), power_supplies (5 pins)
5V2: gate_driver_array (9 pins), power_supplies (5 pins)
15V2: gate_driver_array (18 pins), power_supplies (5 pins)
+15V: sensing_circuits (9 pins), power_supplies (5 pins)
-15V: sensing_circuits (9 pins), power_supplies (5 pins)
GND1: sensing_circuits (38 pins), fo_tx_array (13 pins), power_supplies (14 pins)
GND2: gate_driver_array (33 pins), power_supplies (10 pins)
NetFUSE1_1: sensing_circuits (R1S.1), power_supplies (FUSE1.1 FUSE2.1 FUSE3.1 vac_in.1)
NetPS1_ACN: sensing_circuits (vac_sensor.HV-), power_supplies (PS1.ACN PS2.1 PS3.2 vac_in.2)